# EAGLE design ARUDUINO128-3 (EAGLE 6.1)
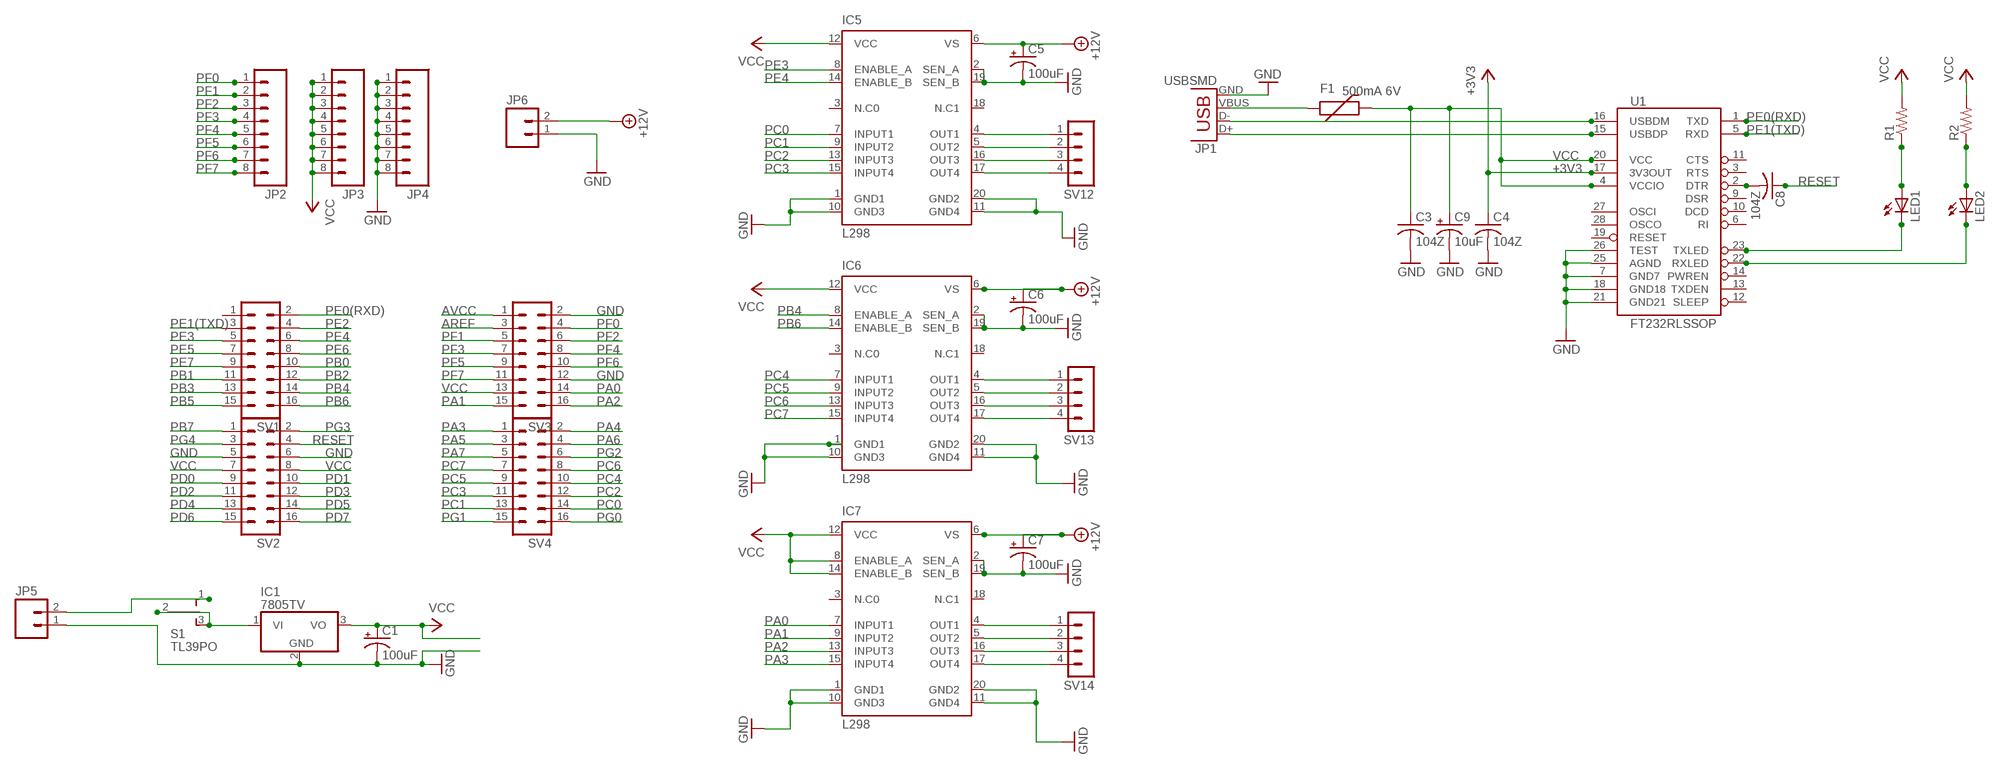
[diagram p0: schematic, sheet 1]

## Parts
C1  100uF  CPOL-US153CLV-0807  [153CLV-0807]
C3  104Z  C-USC0603K  [C0603K]
C4  104Z  C-USC0603K  [C0603K]
C5  100uF  CPOL-US153CLV-0807  [153CLV-0807]
C6  100uF  CPOL-US153CLV-0807  [153CLV-0807]
C7  100uF  CPOL-US153CLV-0807  [153CLV-0807]
C8  104Z  C-USC0603K  [C0603K]
C9  10uF  CPOL-USA/3216-18W  [A/3216-18W]
F1  500mA 6V  PTCSMD  [PTC-1206]
IC1  7805TV  [TO220V]
IC5  L298  [POWERSO-20]
IC6  L298  [POWERSO-20]
IC7  L298  [POWERSO-20]
JP1  USBSMD  [USB-MINIB]
JP2  M08  [1X08_ROUND]
JP3  M08  [1X08_ROUND]
JP4  M08  [1X08_ROUND]
JP5  M02PTH  [1X02]
JP6  M02PTH  [1X02]
LED1  LEDCHIPLED_0603  [CHIPLED_0603]
LED2  LEDCHIPLED_0603  [CHIPLED_0603]
R1  R-US_M0805  [M0805]
R2  R-US_M0805  [M0805]
S1  TL39PO  [TL3XPO]
SV1  MA08-2  [MA08-2]
SV2  MA08-2  [MA08-2]
SV3  MA08-2  [MA08-2]
SV4  MA08-2  [MA08-2]
SV12  MA04-1  [MA04-1]
SV13  MA04-1  [MA04-1]
SV14  MA04-1  [MA04-1]
U1  FT232RLSSOP  [SSOP28DB]

## Nets
+3V3: C4.1 U1.17(3V3OUT)
+12V: C5.+ C6.+ C7.+ IC5.6(VS) IC6.6(VS) IC7.6(VS) JP6.2
AREF: SV3.3
AVCC: SV3.1
GND: C1.- C3.2 C4.2 C5.- C6.- C7.- C9.- IC1.2(GND) IC5.1(GND1) IC5.2(SEN_A) IC5.10(GND3) IC5.11(GND4) IC5.19(SEN_B) IC5.20(GND2) IC6.1(GND1) IC6.2(SEN_A) IC6.10(GND3) IC6.11(GND4) IC6.19(SEN_B) IC6.20(GND2) IC7.1(GND1) IC7.2(SEN_A) IC7.10(GND3) IC7.11(GND4) IC7.19(SEN_B) IC7.20(GND2) JP1.GND JP4.1 JP4.2 JP4.3 JP4.4 JP4.5 JP4.6 JP4.7 JP4.8 JP5.1 JP6.1 SV2.5 SV2.6 SV3.2 SV3.12 U1.7(GND7) U1.18(GND18) U1.21(GND21) U1.25(AGND) U1.26(TEST)
N$1: JP5.2 S1.1(O)
N$2: IC1.1(VI) S1.2(P) S1.3(S)
N$3: F1.1 JP1.VBUS
N$4: JP1.D- U1.16(USBDM)
N$5: JP1.D+ U1.15(USBDP)
N$6: LED1.A R1.1
N$7: LED2.A R2.1
N$8: LED1.C U1.23(TXLED)
N$9: LED2.C U1.22(RXLED)
N$10: C8.2 U1.2(DTR)
N$15: IC5.4(OUT1) SV12.1
N$16: IC5.5(OUT2) SV12.2
N$17: IC5.16(OUT3) SV12.3
N$18: IC5.17(OUT4) SV12.4
N$19: IC6.4(OUT1) SV13.1
N$20: IC6.5(OUT2) SV13.2
N$21: IC6.16(OUT3) SV13.3
N$22: IC6.17(OUT4) SV13.4
N$23: IC7.4(OUT1) SV14.1
N$24: IC7.5(OUT2) SV14.2
N$25: IC7.16(OUT3) SV14.3
N$26: IC7.17(OUT4) SV14.4
PA0: IC7.7(INPUT1) SV3.14
PA1: IC7.9(INPUT2) SV3.15
PA2: IC7.13(INPUT3) SV3.16
PA3: IC7.15(INPUT4) SV4.1
PA4: SV4.2
PA5: SV4.3
PA6: SV4.4
PA7: SV4.5
PB0: SV1.10
PB1: SV1.11
PB2: SV1.12
PB3: SV1.13
PB4: IC6.8(ENABLE_A) SV1.14
PB5: SV1.15
PB6: IC6.14(ENABLE_B) SV1.16
PB7: SV2.1
PC0: IC5.7(INPUT1) SV4.14
PC1: IC5.9(INPUT2) SV4.13
PC2: IC5.13(INPUT3) SV4.12
PC3: IC5.15(INPUT4) SV4.11
PC4: IC6.7(INPUT1) SV4.10
PC5: IC6.9(INPUT2) SV4.9
PC6: IC6.13(INPUT3) SV4.8
PC7: IC6.15(INPUT4) SV4.7
PD0: SV2.9
PD1: SV2.10
PD2: SV2.11
PD3: SV2.12
PD4: SV2.13
PD5: SV2.14
PD6: SV2.15
PD7: SV2.16
PE0(RXD): SV1.2 U1.1(TXD)
PE1(TXD): SV1.3 U1.5(RXD)
PE2: SV1.4
PE3: IC5.8(ENABLE_A) SV1.5
PE4: IC5.14(ENABLE_B) SV1.6
PE5: SV1.7
PE6: SV1.8
PE7: SV1.9
PF0: JP2.1 SV3.4
PF1: JP2.2 SV3.5
PF2: JP2.3 SV3.6
PF3: JP2.4 SV3.7
PF4: JP2.5 SV3.8
PF5: JP2.6 SV3.9
PF6: JP2.7 SV3.10
PF7: JP2.8 SV3.11
PG0: SV4.16
PG1: SV4.15
PG2: SV4.6
PG3: SV2.2
PG4: SV2.3
RESET: C8.1 SV2.4
VCC: C1.+ C3.1 C9.+ F1.2 IC1.3(VO) IC5.12(VCC) IC6.12(VCC) IC7.8(ENABLE_A) IC7.12(VCC) IC7.14(ENABLE_B) JP3.1 JP3.2 JP3.3 JP3.4 JP3.5 JP3.6 JP3.7 JP3.8 R1.2 R2.2 SV2.7 SV2.8 SV3.13 U1.4(VCCIO) U1.20(VCC)
Unconnected: IC5.3(N.C0) IC5.18(N.C1) IC6.3(N.C0) IC6.18(N.C1) IC7.3(N.C0) IC7.18(N.C1) SV1.1 U1.3(RTS) U1.6(RI) U1.9(DSR) U1.10(DCD) U1.11(CTS) U1.12(SLEEP) U1.13(TXDEN) U1.14(PWREN) U1.19(RESET) U1.27(OSCI) U1.28(OSCO)

## Library data of the parts
C1 C5-C7 C9 = rcl:CPOL-US: POLARIZED CAPACITOR, American symbol
C3 C4 C8 = rcl:C-US: CAPACITOR, American symbol
F1 = SparkFun-PowerIC:PTC: Resettable Fuse PTC Resettable Fuse. Spark Fun Electronics SKU : COM-08357; PROD_ID: RES-11150
IC1 = linear:78*: Positive VOLTAGE REGULATOR Source: http://cache.national.com/ds/LM/LM78L05.pdf http://www.fairchildsemi.com/ds/LM/LM7805.pdf
IC5-IC7 = L298-SO20:L298: DUAL FULL-BRIDGE DRIVER
JP1 = SparkFun-Connectors:USB: USB Connectors USB-B-PTH is fully proven SKU : PRT-00139/CONN-08278 USB-miniB is fully proven SKU : PRT-00587 USB-A-PCB is untested. USB-A-H is throughly reviewed, but untested. Spark Fun Electronics SKU : PRT-00437 USB-B-SMT is throughly reviewed, but untested. Needs silkscreen touching up. USB-A-S has not been used/tested USB-MB-H has not been used/tested USB-MICROB has been used. CONN-09505; PROD_ID: CONN-08193
JP2-JP4 = SparkFun-Connectors:M08: Header 8 Standard 8-pin 0.1" header. Use with straight break away headers (SKU : PRT-00116), right angle break away headers (PRT-00553), swiss pins (PRT-00743), machine pins (PRT-00117), and female headers (PRT-00115).
JP5 JP6 = SparkFun-Connectors:M02: Standard 2-pin 0.1" header. Use with - straight break away headers ( PRT-00116) - right angle break away headers (PRT-00553) - swiss pins (PRT-00743) - machine pins (PRT-00117) - female headers (PRT-00115) Molex polarized connector foot print use with: PRT-08233 with associated crimp pins and housings. 2.54_SCREWTERM for use with PRT-10571. 3.5mm Screw Terminal footprints for PRT-08084 5mm Screw Terminal footprints for use with PRT-08432
LED1 LED2 = led:LED: LED OSRAM: - CHIPLED LG R971, LG N971, LY N971, LG Q971, LY Q971, LO R971, LY R971 LH N974, LH R974 LS Q976, LO Q976, LY Q976 LO Q996 - Hyper CHIPLED LW Q18S LB Q993, LB Q99A, LB R99A - SideLED LS A670, LO A670, LY A670, LG A670, LP A670 LB A673, LV A673, LT A673, LW A673 LH A674 LY A675 LS A676, LA A676, LO A676, LY A676, LW A676 LS A679, LY A679, LG A679 - Hyper Micro SIDELED® LS Y876, LA Y876, LO Y876, LY Y876 LT Y87S - SmartLED LW L88C, LW L88S LB L89C, LB L89S, LG L890 LS L89K, LO L89K, LY L89K LS L896, LA L896, LO L896, LY L896 - TOPLED LS T670, LO T670, LY T670, LG T670, LP T670 LSG T670, LSP T670, LSY T670, LOP T670, LYG T670 LG T671, LOG T671, LSG T671 LB T673, LV T673, LT T673, LW T673 LH T674 LS T676, LA T676, LO T676, LY T676, LB T676, LH T676, LSB T676, LW T676 LB T67C, LV T67C, LT T67C, LS T67K, LO T67K, LY T67K, LW E67C LS E67B, LA E67B, LO E67B, LY E67B, LB E67C, LV E67C, LT E67C LW T67C LS T679, LY T679, LG T679 LS T770, LO T770, LY T770, LG T770, LP T770 LB T773, LV T773, LT T773, LW T773 LH T774 LS E675, LA E675, LY E675, LS T675 LS T776, LA T776, LO T776, LY T776, LB T776 LHGB T686 LT T68C, LB T68C - Hyper Mini TOPLED® LB M676 - Mini TOPLED Santana® LG M470 LS M47K, LO M47K, LY M47K Source: http://www.osram.convergy.de LUXEON: - LUMILED® LXK2-PW12-R00, LXK2-PW12-S00, LXK2-PW14-U00, LXK2-PW14-V00 LXK2-PM12-R00, LXK2-PM12-S00, LXK2-PM14-U00 LXK2-PE12-Q00, LXK2-PE12-R00, LXK2-PE12-S00, LXK2-PE14-T00, LXK2-PE14-U00 LXK2-PB12-K00, LXK2-PB12-L00, LXK2-PB12-M00, LXK2-PB14-N00, LXK2-PB14-P00, LXK2-PB14-Q00 LXK2-PR12-L00, LXK2-PR12-M00, LXK2-PR14-Q00, LXK2-PR14-R00 LXK2-PD12-Q00, LXK2-PD12-R00, LXK2-PD12-S00 LXK2-PH12-R00, LXK2-PH12-S00 LXK2-PL12-P00, LXK2-PL12-Q00, LXK2-PL12-R00 Source: www.luxeon.com KINGBRIGHT: KA-3528ASYC Source: www.kingbright.com
R1 R2 = rcl:R-US_: RESISTOR, American symbol
S1 = switch:TL39PO: TINY SWITCH ON OFF ON Source: http://www2.produktinfo.conrad.com/datenblaetter/700000-724999/705152-da-01-de-Subminiaturschalter_TL_36YO.pdf
SV1-SV4 = con-lstb:MA08-2: PIN HEADER; OC_FARNELL: unknown; OC_NEWARK: unknown
SV12-SV14 = con-lstb:MA04-1: PIN HEADER; OC_FARNELL: unknown; OC_NEWARK: unknown
U1 = SparkFun-DigitalIC:FT232RL: USB UART FT232RL 4th Generation USB UART (USB <-> Serial) Controller. Spark Fun Electronics SKU : COM-00650 Production SKU IC-00870; PROD_ID: IC-00870

## Board
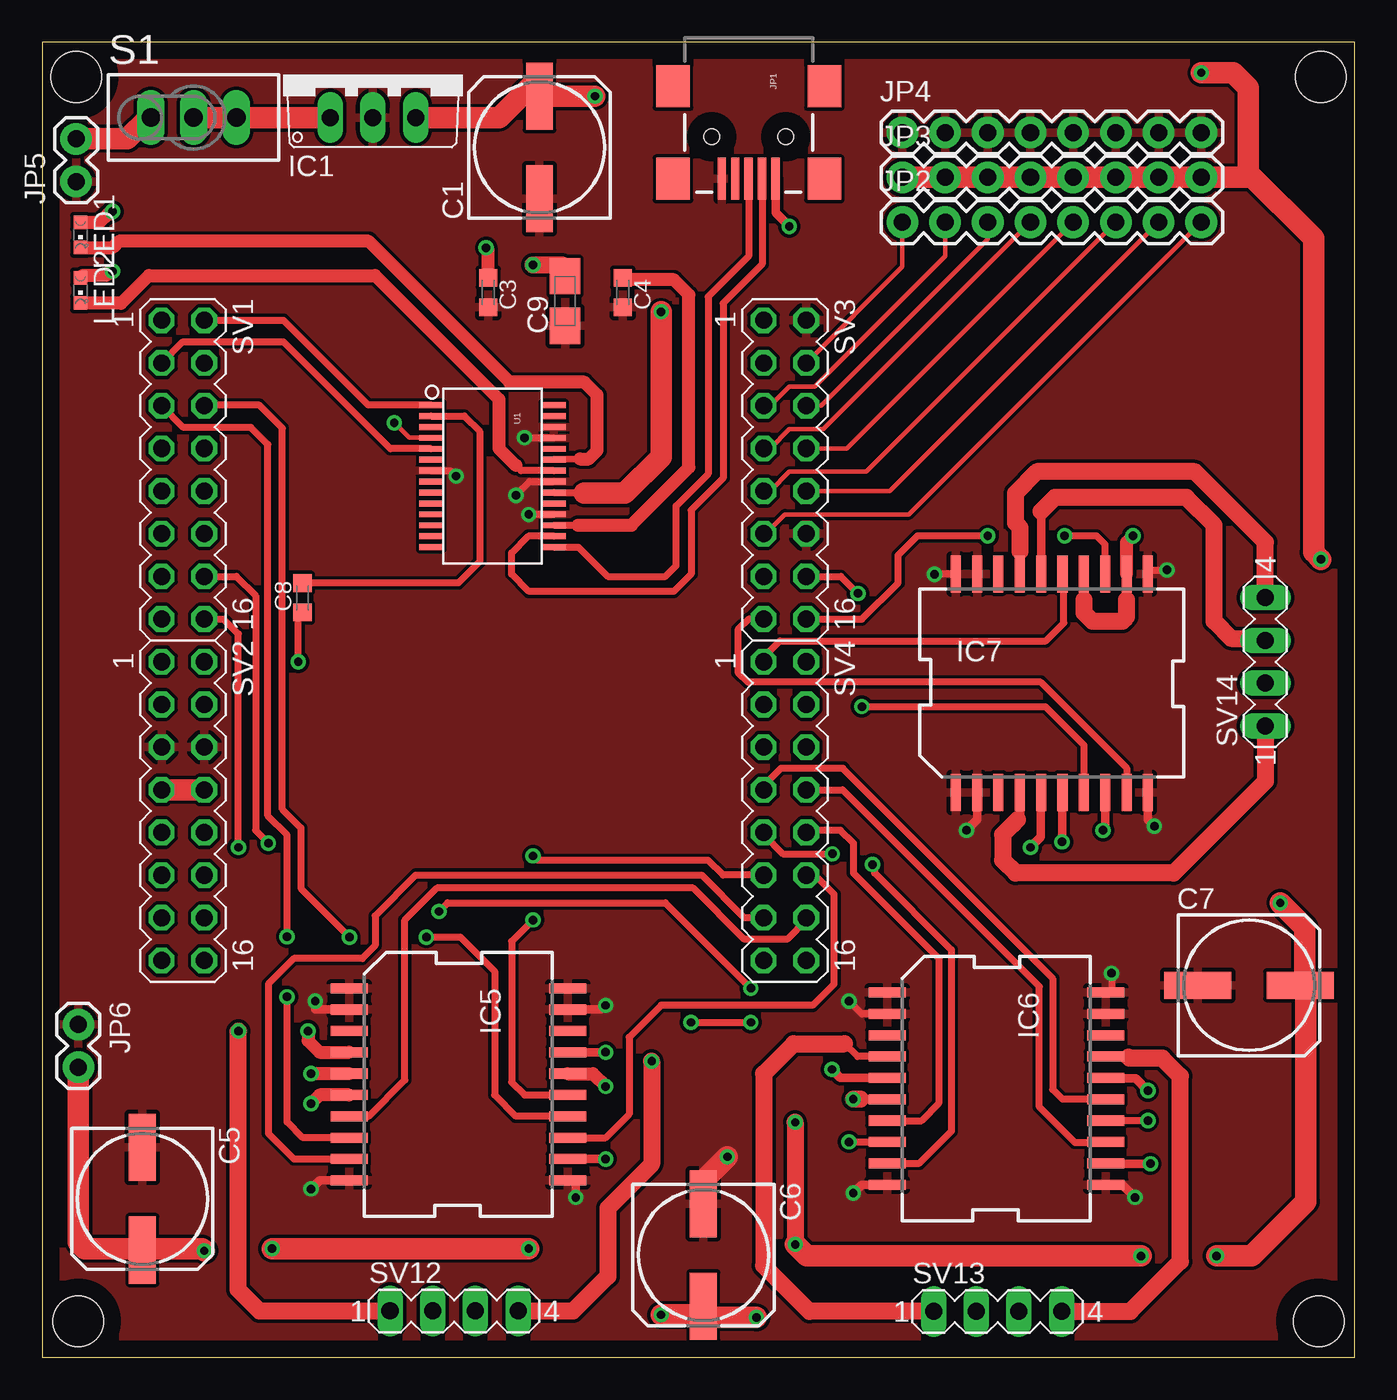
[diagram p1: board, top side]
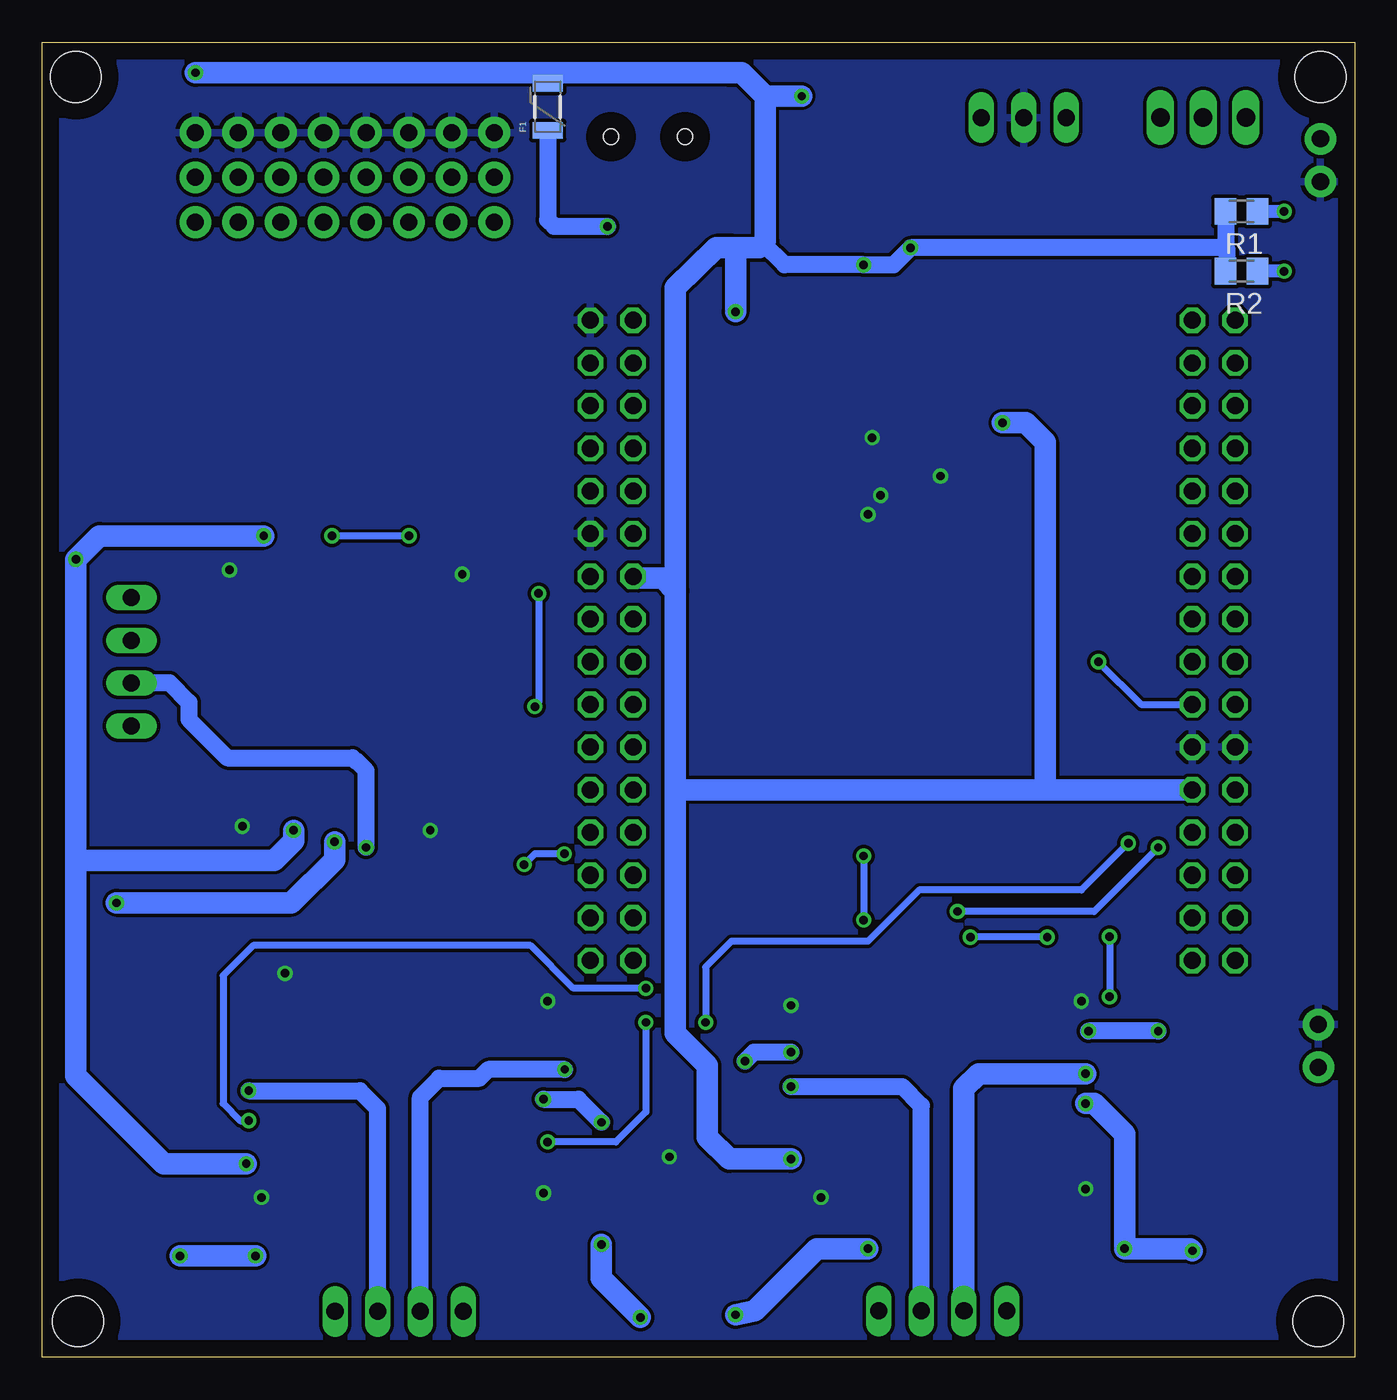
[diagram p2: board, bottom side, seen from below]

Size 78.08 x 78.28 mm. Coordinates in mm from the lower left corner, seen from the top.
Outline: 0,0 78.08,0 78.08,78.28 0,78.28 0,0
Copper layers (1*16): Top 0.035mm / dielectric 1.5mm / Bottom 0.035mm
Design rules: minimum track width 10mil, minimum drill 24mil, track to track 8mil, track to pad 8mil, pad to pad 8mil, via to via 8mil, smd to smd 8mil, copper to edge 40mil, drill to drill 8mil, minimum pad ring 10mil, minimum via ring 8mil, stop-mask expansion 4mil, vias tented up to drill 0mil, thermal gap 10mil
Holes 3 mm at 2.16,2.16 75.95,2.16 2.03,76.2 76.07,76.2

### Footprints (pad centres in the part's own frame; a part is rotated, then mirrored left to right if it is on the bottom)
153CLV-0807 = smd 4 x 1.6: + 3.05,0; - -3.05,0
C0603K = smd 1.05 x 1.08: 1 -0.875,0; 2 0.875,0
A/3216-18W = smd 2.15 x 1.8: + 1.475,0; - -1.475,0
PTC-1206 = smd 1 x 1.8: 1 -1.4,0; 2 1.4,0
TO220V = drill 1.016 long: 1 -2.54,-2.54; 2 0,-2.54; 3 2.54,-2.54
POWERSO-20 = smd 0.6 x 2.2: 1 -5.715,-6.5; 2 -4.445,-6.5; 3 -3.175,-6.5; 4 -1.905,-6.5; 5 -0.635,-6.5; 6 0.635,-6.5; 7 1.905,-6.5; 8 3.175,-6.5; 9 4.445,-6.5; 10 5.715,-6.5; 11 5.715,6.5; 12 4.445,6.5; 13 3.175,6.5; 14 1.905,6.5; 15 0.635,6.5; 16 -0.635,6.5; 17 -1.905,6.5; 18 -3.175,6.5; 19 -4.445,6.5; 20 -5.715,6.5
USB-MINIB = smd 2.5 x 0.5: D+ 2.5,0; D- 2.5,0.8; GND 2.5,-1.6; ID 2.5,-0.8; VBUS 2.5,1.6 | smd 2.5 x 2: MTN1 -3,4.5; MTN2 2.5,4.5; MTN3 -3,-4.5; MTN4 2.5,-4.5 | hole 0.9: 0,2.2; 0,-2.2
1X08_ROUND = drill 1.016 pad 1.88: 1 0,0; 2 2.54,0; 3 5.08,0; 4 7.62,0; 5 10.16,0; 6 12.7,0; 7 15.24,0; 8 17.78,0
1X02 = drill 1.016 pad 1.88: 1 0,0; 2 2.54,0
CHIPLED_0603 = smd 0.8 x 0.8: A 0,-0.75; C 0,0.75
M0805 = smd 1.3 x 1.6: 1 -0.95,0; 2 0.95,0
TL3XPO = drill 1.1 pad 1.422 long: 1 -2.54,0; 2 0,0; 3 2.54,0
MA08-2 = drill 1.016 octagon: 1 -8.89,-1.27; 2 -8.89,1.27; 3 -6.35,-1.27; 4 -6.35,1.27; 5 -3.81,-1.27; 6 -3.81,1.27; 7 -1.27,-1.27; 8 -1.27,1.27; 9 1.27,-1.27; 10 1.27,1.27; 11 3.81,-1.27; 12 3.81,1.27; 13 6.35,-1.27; 14 6.35,1.27; 15 8.89,-1.27; 16 8.89,1.27
MA04-1 = drill 1.016 long: 1 -3.81,0; 2 -1.27,0; 3 1.27,0; 4 3.81,0
SSOP28DB = smd 0.348 x 1.397: 1 -4.225,-3.656; 2 -3.575,-3.656; 3 -2.925,-3.656; 4 -2.275,-3.656; 5 -1.625,-3.656; 6 -0.975,-3.656; 7 -0.325,-3.656; 8 0.325,-3.656; 9 0.975,-3.656; 10 1.625,-3.656; 11 2.275,-3.656; 12 2.925,-3.656; 13 3.575,-3.656; 14 4.225,-3.656; 15 4.225,3.656; 16 3.575,3.656; 17 2.925,3.656; 18 2.275,3.656; 19 1.625,3.656; 20 0.975,3.656; 21 0.325,3.656; 22 -0.325,3.656; 23 -0.975,3.656; 24 -1.625,3.656; 25 -2.275,3.656; 26 -2.925,3.656; 27 -3.575,3.656; 28 -4.225,3.656

### Placement (x,y rotation side)
C1  29.59,72.01 90 top
C3  26.54,63.37 270 top
C4  34.54,63.37 270 top
C5  5.97,9.45 270 top
C6  39.34,6.1 270 top
C7  71.81,22.15 0 top
C8  15.49,45.21 90 top
C9  31.11,62.86 90 top
F1  48.01,74.42 90 bottom
IC1  19.68,76.33 0 top
IC5  24.77,16.26 270 top
IC6  56.77,16 270 top
IC7  60.07,40.13 0 top
JP1  42.04,72.64 270 top
JP2  51.18,67.56 0 top
JP3  51.18,70.23 0 top
JP4  51.18,72.9 0 top
JP5  2.03,69.98 90 top
JP6  2.16,19.81 270 top
LED1  2.29,66.8 180 top
LED2  2.29,63.5 180 top
R1  6.73,68.2 180 bottom
R2  6.73,64.64 180 bottom
S1  9.02,73.79 0 top
SV1  8.38,52.83 270 top
SV2  8.38,32.51 270 top
SV3  44.19,52.83 270 top
SV4  44.19,32.51 270 top
SV12  24.51,2.77 0 top
SV13  56.85,2.74 0 top
SV14  72.77,41.4 90 top
U1  26.8,52.45 270 top

### Tracks (layer width: path | path; a pad name or v marks a point on that pad's centre or on a via)
+3V3
  Top 0.406: U1.17 31.87,49.53 31.88,49.53
  Top 0.762: 31.88,49.53 35.05,49.53 38.48,52.96 38.48,63.25 37.59,64.14 34.66,64.14 C4.1
+12V  (via drill 0.5)
  Top 0.254: 74.93,22.22 C7.+
  Top 0.406: C5.+ 5.26,6.4 5.33,6.48
  Top 0.508: 48.69,15.37 IC6.6 | v60.68,30.68 60.68,33.61 IC7.6
  Top 0.762: IC5.6 16.51,15.62 v16,15.11
  Top 1.016: 48.69,15.37 v48.26,15.37 | v44.81,14 v44.81,6.73
  Top 1.27: v9.65,6.35 9.53,6.48 5.33,6.48 2.54,6.48 2.16,6.86 JP6.2 | v42.49,2.39 39.75,2.39 C6.+ 39.37,2.77 39.37,2.54 v36.83,2.54 | v69.88,6.04 71.96,6.04 75.18,9.27 75.18,21.97 74.93,22.22 | v73.66,27.05 75.11,25.6 75.11,22.4 C7.+ | v65.38,6.04 45.49,6.04 v44.81,6.73 | v28.96,6.48 v13.69,6.48
  Bottom 1.016: v48.26,15.37 46.18,15.37 v44.81,14
  Bottom 1.27: v69.88,6.04 v65.38,6.04 | v16,15.11 15.49,15.11 13.69,13.31 v13.69,6.48 9.78,6.48 v9.65,6.35 | v60.68,30.68 60.68,29.62 63.25,27.05 v73.66,27.05 | v28.96,6.48 32,6.48 35.69,2.79 v36.83,2.54 | v44.81,6.73 44.81,4.7 v42.49,2.39
GND  (via drill 0.5)
  Top 0.406: IC6.11 64.26,10.29 | 50.29,21.72 IC6.1 | v28.19,51.31 29.01,52.13 U1.21 | U1.18 28.97,50.18 v28.96,50.16 | U1.7 24.31,52.78 v24.64,52.45 | 29.46,54.74 29.48,54.73 U1.25 28.71,54.73 v28.7,54.74 | v63.63,22.86 63.63,21.72 IC6.20 | IC6.2 48.77,20.45 v48.01,21.21 | 65.79,46.86 v66.93,46.86 | IC7.20 53.11,46.63 v53.09,46.61
  Top 0.508: IC5.10 16.51,10.54 v16,10.03 | 31.24,10.54 31.75,10.54 v31.75,9.53 | IC7.2 55.63,32 v54.99,31.37 | IC7.10 65.79,32 v66.17,31.62 | IC6.10 48.77,10.29 v48.26,9.78 | 64.26,10.29 v65.02,9.53 | IC5.2 16.26,20.7 v16.26,21.21 | 31.24,20.7 33.27,20.7 v33.53,20.95
  Top 1.27: v40.77,11.94 39.37,10.54 39.37,8.92 C6.-
  pour Bottom: -2.29,-4.19 -2.54,81.15 80.39,81.15 80.39,-4.19
  pour Top: -1.27,-2.92 -1.27,80.01 79.38,80.01 79.38,-3.17
N$1
  Top 1.27: S1.1 6.35,73.79 5.08,72.52 JP5.2
N$2
  Top 1.27: IC1.1 S1.3 S1.2
N$3  (via drill 0.5)
  Top 0.508: JP1.VBUS 43.64,68.12 v44.45,67.31
  Bottom 1.016: F1.1 48.01,67.69 47.62,67.31 v44.45,67.31
N$4
  Top 0.406: JP1.D- 42.84,65.06 40.51,62.74 40.51,52.32 38.61,50.42 38.61,46.61 37.59,45.59 28.96,45.59 27.94,46.61 27.94,47.88 28.94,48.88 U1.16
N$5
  Top 0.406: JP1.D+ 42.04,65.53 39.62,63.12 39.62,52.58 37.72,50.67 37.72,47.12 37.08,46.48 33.66,46.48 31.91,48.23 U1.15
N$6  (via drill 0.5)
  Top 0.762: v4.19,68.2 4.05,68.06 3.92,68.06 3.42,67.55 LED1.A
  Bottom 0.406: 5.59,68.2 R1.1
  Bottom 0.762: v4.19,68.2 5.59,68.2
N$7  (via drill 0.5)
  Top 0.762: v4.19,64.64 4.06,64.64 3.81,64.39 2.42,64.39 LED2.A
  Bottom 0.762: v4.19,64.64 R2.1
N$8
  Top 0.381: 32,53.47 30.49,53.47 U1.23
  Top 0.762: LED1.C 4.2,66.05 4.57,66.42 19.43,66.42 27.81,58.04 32.26,58.04 33.02,57.28 33.02,53.98 32.51,53.47 32,53.47
N$9
  Top 0.254: LED2.C 2.54,62.86 2.54,62.74
  Top 0.406: U1.22 28.5,52.78 28.19,53.09
  Top 0.762: 2.54,62.74 4.7,62.74 6.35,64.39 19.81,64.39 27.18,57.02 27.18,54.1 28.19,53.09
N$10
  Top 0.406: U1.2 25.13,56.03 26.04,55.12 26.04,47.37 24.77,46.1 15.49,46.1 C8.2
N$15  (via drill 0.5)
  Top 0.762: v15.82,19.43 15.82,18.85 16.51,18.16 IC5.4
  Top 1.016: SV12.1 12.93,2.77 11.66,4.04 11.66,19.41 v11.68,19.43
  Bottom 1.016: v11.68,19.43 v15.82,19.43
N$16  (via drill 0.5)
  Top 0.762: IC5.5 v16,16.89
  Bottom 1.27: v16,16.89 22.35,16.89 23.24,16 SV12.2
N$17  (via drill 0.5)
  Top 0.762: IC5.16 32.77,16.89 v33.53,16.13
  Bottom 1.016: v33.53,16.13 26.92,16.13 25.78,14.99 SV12.3
N$18  (via drill 0.5)
  Top 0.508: IC5.17 v33.53,18.16
  Top 1.016: SV12.4 31.6,2.77 33.66,4.83 33.66,8.89 36.27,11.51 v36.27,17.63
  Bottom 1.016: v33.53,18.16 35.74,18.16 v36.27,17.63
N$19
  Top 0.406: IC6.4 48.51,17.91 47.75,18.67
  Top 1.016: SV13.1 45.64,2.74 42.93,5.46 42.93,16.89 44.7,18.67 47.75,18.67
N$20  (via drill 0.5)
  Top 0.508: IC6.5 47.5,16.64 v46.99,17.14
  Bottom 1.016: v46.99,17.14 51.54,17.14 52.07,16.61 54.46,16.61 55.58,15.49 SV13.2
N$21  (via drill 0.5)
  Top 0.508: IC6.16 62.61,16.61 65.05,16.61 v65.79,15.88
  Bottom 1.016: v65.79,15.88 59.18,15.88 58.12,14.81 SV13.3
N$22
  Top 0.508: 64.62,17.88 63.29,17.88 IC6.17
  Top 1.016: SV13.4 64.75,2.74 67.72,5.71 67.72,16.74 66.65,17.8 64.69,17.8 64.62,17.88
N$23
  Top 0.508: IC7.4 58.19,33.61 58.19,32.41 | 58.19,32.41 57.91,32.13 | 57.78,31.75 58.17,32.13 58.17,32.23 58.19,32.26 58.19,32.41
  Top 1.016: 58.04,32 57.78,31.75 57.15,31.12 57.15,29.59 57.91,28.83 67.31,28.83 72.77,34.29 SV14.1
N$24  (via drill 0.5)
  Top 0.508: IC7.5 59.41,33.66 59.41,30.96 v58.8,30.35
  Bottom 1.016: SV14.2 72.75,40.16 70.51,40.16 69.34,38.99 69.34,37.97 67.06,35.69 59.61,35.69 59.41,35.48 59.36,35.48 58.8,34.92 v58.8,30.35
N$25
  Top 0.508: IC7.16 59.44,50.37
  Top 1.016: SV14.3 72.64,42.8 70.74,42.8 69.72,43.81 69.72,49.53 68.07,51.18 60.25,51.18 59.44,50.37
N$26
  Top 0.508: 58.19,47.98 58.19,46.66 IC7.17
  Top 1.016: 58.19,47.98 58.19,49.38 57.91,49.66 57.91,51.44 59.18,52.7 68.58,52.7 72.77,48.51 SV14.4
PA0  (via drill 0.5)
  Top 0.406: SV3.14 47.52,46.48 v48.54,45.47 | v48.77,38.73 59.69,38.73 61.98,36.45 IC7.7
  Bottom 0.406: v48.54,45.47 48.54,38.96 v48.77,38.73
PA1
  Top 0.406: IC7.9 64.52,35.08 59.41,40.18 41.99,40.18 41.4,40.77 41.4,43.31 42.04,43.94 SV3.15
PA2  (via drill 0.5)
  Top 0.406: SV3.16 48.77,43.94 50.93,46.1 50.93,47.75 52.07,48.89 v56.26,48.89 | IC7.13 63.25,48.39 62.74,48.89 v60.83,48.89
  Bottom 0.406: v56.26,48.89 v60.83,48.89
PA3
  Top 0.406: SV4.1 42.92,41.68 43.89,42.65 59.72,42.65 60.78,43.71 60.78,46.56 IC7.15
PB4  (via drill 0.5)
  Top 0.406: SV1.14 11.56,46.48 12.7,45.34 12.7,31.37 v13.46,30.61 | v38.61,19.94 v42.16,19.94 | v48.01,12.83 IC6.8
  Bottom 0.406: v13.46,30.61 16.26,27.81 25.91,27.81 28.96,24.77 37.08,24.77 38.61,23.24 v38.61,19.94 | v42.16,19.94 42.16,14.61 43.94,12.83 v48.01,12.83
PB6  (via drill 0.5)
  Top 0.406: v23.62,26.54 24.13,27.05 37.08,27.05 v42.16,21.97 | v65.79,14.1 IC6.14 63.25,14.1 | v11.68,30.35 11.68,43.05 10.79,43.94 SV1.16
  Bottom 0.406: v23.62,26.54 15.49,26.54 v11.68,30.35 | v42.16,21.97 46.48,21.97 49.02,24.51 65.53,24.51 67.31,22.73 67.31,15.11 66.29,14.1 v65.79,14.1
PC0
  Top 0.406: SV4.14 45.46,26.03 44.32,24.89 41.78,24.89 38.73,27.94 23.5,27.94 21.59,26.04 21.59,16.51 19.43,14.35 IC5.7
PC1
  Top 0.406: IC5.9 14.99,11.81 13.46,13.34 13.46,22.22 14.99,23.75 19.05,23.75 19.81,24.51 19.81,26.29 22.23,28.7 39.24,28.7 41.78,26.16 SV4.13
PC2
  Top 0.406: IC5.13 33.53,13.08 34.92,14.48 34.92,19.05 36.83,20.95 45.85,20.95 47.12,22.22 47.12,27.56 45.97,28.7 SV4.12
PC3  (via drill 0.5)
  Top 0.406: IC5.15 28.7,15.62 27.94,16.38 27.94,24.77 v29.21,26.04 | SV4.11 40.51,28.7 39.62,29.59 29.46,29.59 v29.21,29.84
  Bottom 0.406: v29.21,29.84 v29.21,26.04
PC4
  Top 0.406: SV4.10 45.59,31.37 47.5,31.37 48.26,30.61 48.26,28.83 53.34,23.75 53.34,15.11 52.32,14.1 IC6.7
PC5  (via drill 0.5)
  Top 0.406: SV4.9 42.92,31.12 44.07,29.97 v47.02,29.97 | IC6.9 52.2,11.56 54.1,13.46 54.1,24.26 49.53,28.83 49.53,29.21 v49.4,29.34
  Bottom 0.406: v47.02,29.97 48.77,29.97 v49.4,29.34
PC6
  Top 0.406: IC6.13 63.24,12.8 61.44,12.8 59.33,14.91 59.33,22.07 47.62,33.78 SV4.8
PC7
  Top 0.406: SV4.7 42.92,34.03 43.97,35.08 47.65,35.08 47.65,35.03 60.12,22.55 60.12,15.95 60.71,15.37 IC6.15
PE0(RXD)
  Top 0.406: SV1.2 14.35,61.72 19.4,56.68 U1.1
PE1(TXD)
  Top 0.406: SV1.3 8.38,60.45 14.35,60.45 20.73,54.08 U1.5
PE3  (via drill 0.5)
  Top 0.406: IC5.8 15.52,13.08 14.58,14.02 v14.58,21.46 | v14.58,25.04 14.58,31.09 13.44,32.23 13.44,54.33 12.42,55.35 8.41,55.35 SV1.5
  Bottom 0.406: v14.58,25.04 v14.58,21.46
PE4  (via drill 0.5)
  Top 0.406: IC5.14 28.19,14.35 26.92,15.62 26.92,22.99 24.89,25.02 v22.86,25.02 | SV1.6 9.68,56.67 12.93,56.67 14.3,55.3 14.3,32.61 15.39,31.52 15.39,27.91 v18.29,25.02
  Bottom 0.406: v18.29,25.02 v22.86,25.02
PF0
  Top 0.254: JP2.1 51.18,64.9 SV3.4
PF1
  Top 0.254: JP2.2 53.72,65.53 45.97,57.78 44.45,57.78 43.31,56.64 SV3.5
PF2
  Top 0.254: JP2.3 56.26,66.55 46.35,56.64 SV3.6
PF3
  Top 0.254: SV3.7 43.31,54.1 44.45,55.24 46.48,55.24 JP2.4
PF4
  Top 0.254: SV3.8 47.88,54.1 JP2.5
PF5
  Top 0.254: SV3.9 43.31,51.56 44.45,52.7 49.02,52.7 JP2.6
PF6
  Top 0.254: SV3.10 50.42,51.56 JP2.7
PF7
  Top 0.254: SV3.11 43.05,49.02 44.2,50.16 51.56,50.16 JP2.8
RESET  (via drill 0.5)
  Top 0.406: v15.24,41.4 15.24,44.08 C8.1
  Bottom 0.406: v15.24,41.4 12.7,38.86 SV2.4
VCC  (via drill 0.5)
  Top 0.254: v20.95,55.63 21.84,54.74 23.13,54.74 U1.4
  Top 0.406: U1.20 32.22,51.48 32.26,51.44 | C9.+ 31.11,64.9 | 63.25,11.56 IC6.12 | IC7.14 61.98,45.09 | 64.52,45.09 IC7.12
  Top 0.508: IC7.8 63.25,31.5 v63.12,31.37 | IC5.12 v33.53,11.81 | v65.94,11.53 63.29,11.53 IC6.12
  Top 0.762: C3.1 26.54,65.91 v26.42,66.04 | v64.9,48.89 64.52,48.51 IC7.12
  Top 1.016: v29.21,65.02 30.94,65.02 C9.+ | 61.98,45.09 61.98,44.32 62.48,43.81 64.26,43.81 64.52,44.07 64.52,45.09
  Top 1.27: IC1.3 27.2,73.79 29.49,76.07 29.46,75.31 C1.+ v32.89,75.06 | 32.26,51.44 34.67,51.44 36.83,53.59 v36.83,62.23 | SV2.8 SV2.7 | JP3.1 JP3.2 JP3.3 JP3.4 JP3.5 JP3.6 JP3.7 JP3.8 71.75,70.23 71.75,70.48 | v68.96,76.45 70.87,76.45 71.75,75.56 71.75,70.48 | 71.75,70.48 75.64,66.6 75.64,47.93 v76.07,47.5
  Bottom 0.254: SV3.13 43.18,46.35 42.85,46.38 | 40.26,33.78 40.64,33.66 40.41,33.66
  Bottom 0.406: 37.34,76.58 47.24,76.58 48.01,76.45
  Bottom 0.508: 37.34,76.58 37.21,76.45
  Bottom 1.016: 7.62,66.04 7.62,64.7 R2.2 | R1.2 7.68,66.1 7.62,66.04 | 7.62,66.04 v26.42,66.04 27.43,65.02 v29.21,65.02 33.91,65.02 35.18,66.29 | 48.01,76.45 F1.2
  Bottom 1.27: 40.41,45.62 40.41,33.66 40.41,19.28 38.51,17.37 38.51,13.11 37.21,11.81 v33.53,11.81 | 40.41,45.62 41.17,46.38 42.85,46.38 42.98,46.51 | v68.96,76.45 48.01,76.45 37.21,76.45 36.45,76.45 35.05,75.06 | 36.96,66.04 37.97,66.04 40.41,63.65 40.41,45.62 | 36.96,66.04 36.83,65.91 v36.83,62.23 | v65.94,11.53 70.84,11.53 76.07,16.76 76.07,29.59 | 36.96,66.04 35.43,66.04 35.18,66.29 35.05,66.42 35.05,74.8 35.05,75.06 | v32.89,75.06 35.05,75.06 | v20.95,55.63 19.56,55.63 18.41,54.48 18.41,34.16 18.03,33.78 | SV2.8 18.03,33.78 | 18.03,33.78 40.26,33.78 40.39,33.91 | v63.12,31.37 63.12,30.73 64.26,29.59 76.07,29.59 | 76.07,29.59 v76.07,47.5 74.68,48.89 v64.9,48.89